# EAGLE design MurataBreakout_rev2 (EAGLE 8.3.1)
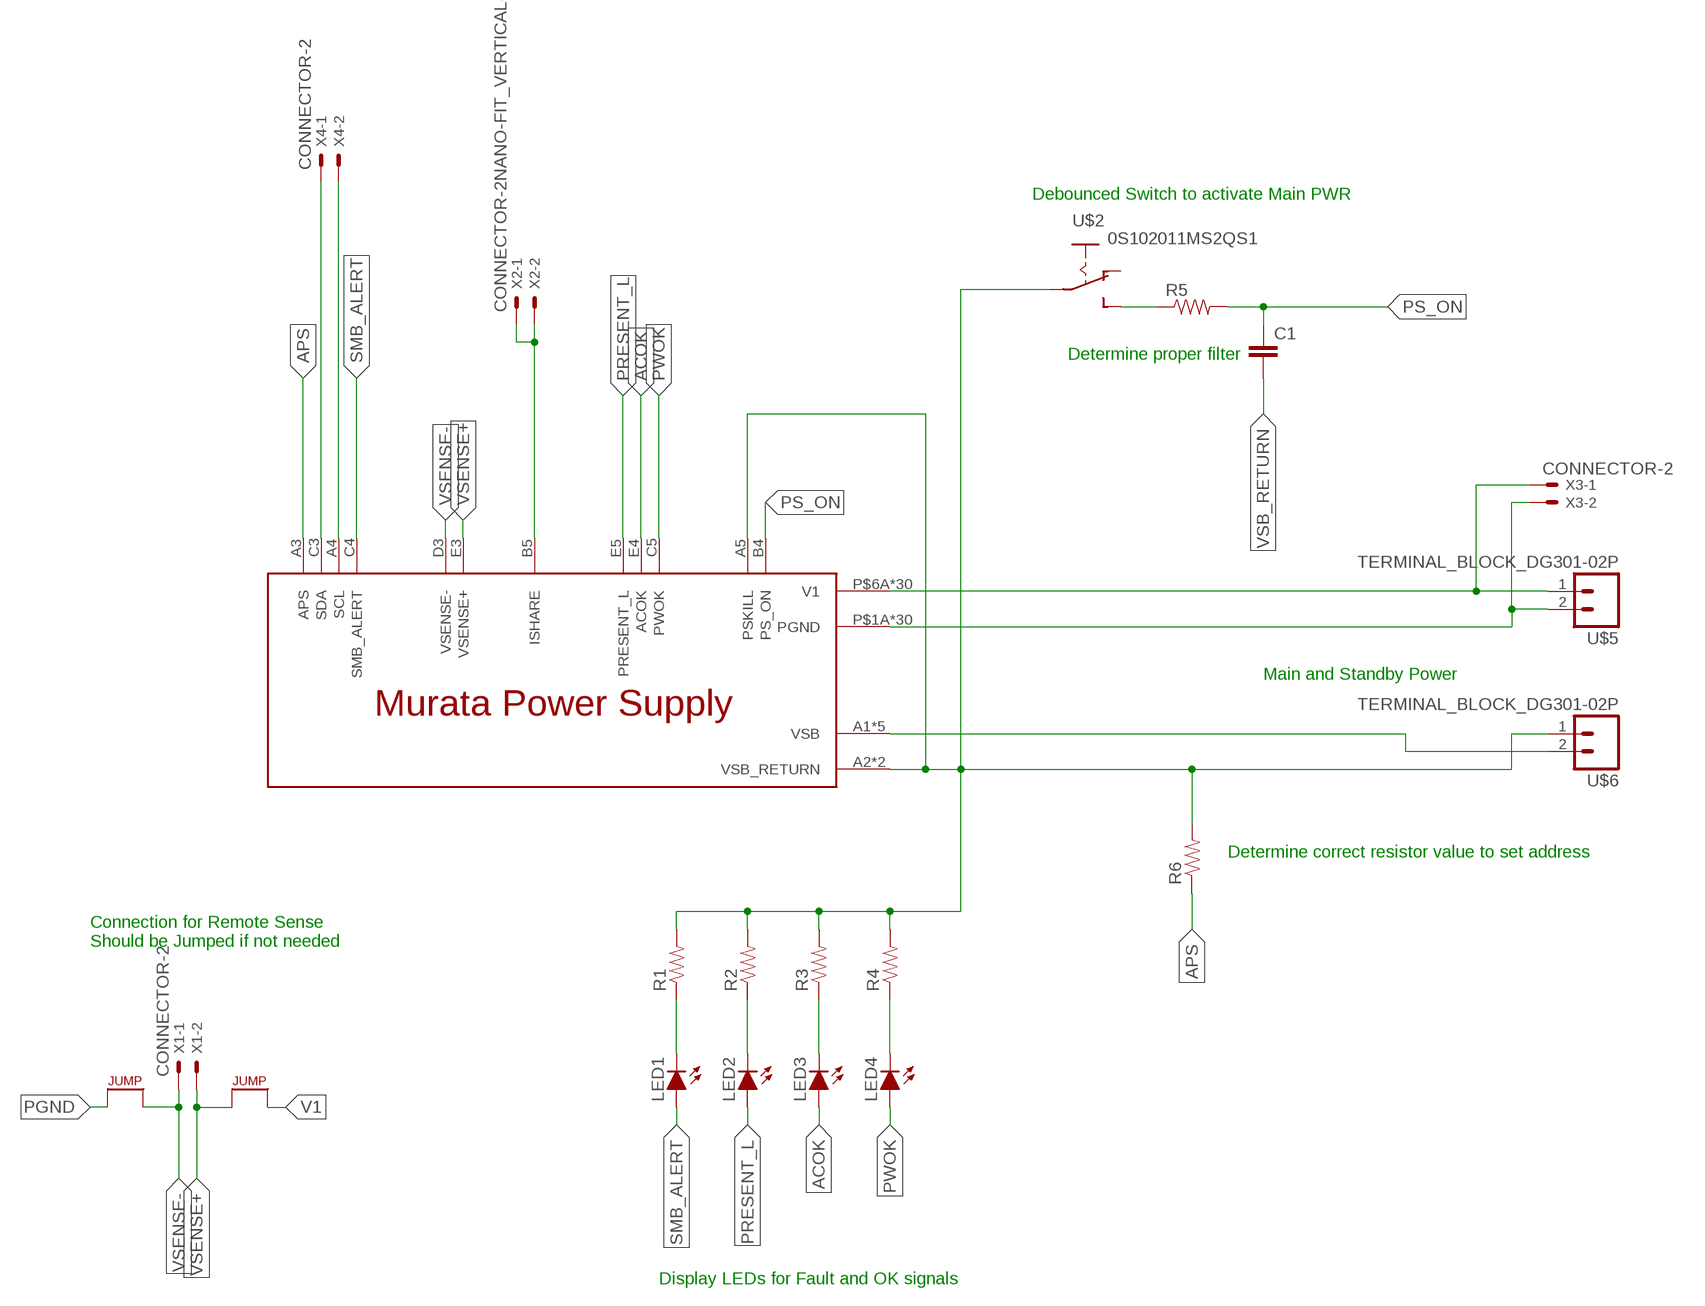
[diagram p0: schematic, sheet 1]

## Parts
C1  CAP0805  [0805]
LED1  LED-0805  [LED-805]
LED2  LED-0805  [LED-805]
LED3  LED-0805  [LED-805]
LED4  LED-0805  [LED-805]
R1  RESISTOR0805-RES  [0805]
R2  RESISTOR0805-RES  [0805]
R3  RESISTOR0805-RES  [0805]
R4  RESISTOR0805-RES  [0805]
R5  RESISTOR0805-RES  [0805]
R6  RESISTOR0805-RES  [0805]
U$1  MURATA_POWER_SUPPLY  [MURATA_POWER_SUPPLY_CONNECTOR]
U$2  0S102011MS2QS1  [0S102011MS2QS1]
U$3  JUMPER.1  [1X02]
U$4  JUMPER.1  [1X02]
U$5  TERMINAL_BLOCK_DG301-02P  [DG301-02P]
U$6  TERMINAL_BLOCK_DG301-02P  [DG301-02P]
X1  CONNECTOR-2  [MINIFIT_5566-2]
X2  CONNECTOR-2NANO-FIT_VERTICAL-2  [NANO-FIT_VERTICAL-2]
X3  CONNECTOR-2  [MINIFIT_5566-2]
X4  CONNECTOR-2  [MINIFIT_5566-2]

## Nets
ACOK: LED3.A U$1.E4(ACOK)
APS: R6.1 U$1.A3(APS)
N$1: LED4.C R4.1
N$2: LED3.C R3.1
N$3: LED2.C R2.1
N$4: LED1.C R1.1
N$5: U$1.B5(ISHARE) X2.P$1 X2.P$2
N$6: R5.1 U$2.P$3(S)
N$7: U$1.A1(VSB) U$1.B1(VSB) U$1.C1(VSB) U$1.D1(VSB) U$1.E1(VSB) U$6.2
PGND: U$1.P$1A(PGND) U$1.P$1B(PGND) U$1.P$1C(PGND) U$1.P$1D(PGND) U$1.P$1E(PGND) U$1.P$1F(PGND) U$1.P$2A(PGND) U$1.P$2B(PGND) U$1.P$2C(PGND) U$1.P$2D(PGND) U$1.P$2E(PGND) U$1.P$2F(PGND) U$1.P$3A(PGND) U$1.P$3B(PGND) U$1.P$3C(PGND) U$1.P$3D(PGND) U$1.P$3E(PGND) U$1.P$3F(PGND) U$1.P$4A(PGND) U$1.P$4B(PGND) U$1.P$4C(PGND) U$1.P$4D(PGND) U$1.P$4E(PGND) U$1.P$4F(PGND) U$1.P$5A(PGND) U$1.P$5B(PGND) U$1.P$5C(PGND) U$1.P$5D(PGND) U$1.P$5E(PGND) U$1.P$5F(PGND) U$4.1 U$5.2 X3.2
PRESENT_L: LED2.A U$1.E5(PRESENT_L)
PS_ON: C1.1 R5.2 U$1.B4(PS_ON)
PWOK: LED4.A U$1.C5(PWOK)
SCL: U$1.A4(SCL) X4.2
SDA: U$1.C3(SDA) X4.1
SMB_ALERT: LED1.A U$1.C4(SMB_ALERT)
V1: U$1.P$6A(V1) U$1.P$6B(V1) U$1.P$6C(V1) U$1.P$6D(V1) U$1.P$6E(V1) U$1.P$6F(V1) U$1.P$7A(V1) U$1.P$7B(V1) U$1.P$7C(V1) U$1.P$7D(V1) U$1.P$7E(V1) U$1.P$7F(V1) U$1.P$8A(V1) U$1.P$8B(V1) U$1.P$8C(V1) U$1.P$8D(V1) U$1.P$8E(V1) U$1.P$8F(V1) U$1.P$9A(V1) U$1.P$9B(V1) U$1.P$9C(V1) U$1.P$9D(V1) U$1.P$9E(V1) U$1.P$9F(V1) U$1.P$10A(V1) U$1.P$10B(V1) U$1.P$10C(V1) U$1.P$10D(V1) U$1.P$10E(V1) U$1.P$10F(V1) U$3.2 U$5.1 X3.1
VSB_RETURN: C1.2 R1.2 R2.2 R3.2 R4.2 R6.2 U$1.A2(VSB_RETURN) U$1.A5(PSKILL) U$1.B2(VSB_RETURN) U$2.P$2(P) U$6.1
VSENSE+: U$1.E3(VSENSE+) U$3.1 X1.2
VSENSE-: U$1.D3(VSENSE-) U$4.2 X1.1
Unconnected: U$2.P$1(O)

## Notes on the sheet
- Debounced Switch to activate Main PWR
- Determine proper filter
- Main and Standby Power
- Determine correct resistor value to set address
- Connection for Remote Sense
  Should be Jumped if not needed
- Display LEDs for Fault and OK signals

## Library data of the parts
C1 = HyTechDevices:CAP: Capacitor Standard 0603 ceramic capacitor, and 0.1" leaded capacitor.
LED1-LED4 = HyTechDevices:LED: Light Emitting Diode (LED) Source: Dangerous Prototypes Eagle Library <https://github.com/DangerousPrototypes/Eagle_Part_Library>
R1-R6 = HyTechDevices:RESISTOR: Resistor Basic schematic elements and footprints for 0603, 1206, and PTH resistors.
U$1 = HyTechDevices:MURATA_POWER_SUPPLY
U$2 = HyTechDevices:0S102011MS2QS1: Slide Switch 0S102011MS2QS1
U$3 U$4 = HyTechDevices:JUMPER: Jumper for changing operation of a device
U$5 U$6 = HyTechDevices:TERMINAL_BLOCK_DG301-02P: DG301-02P Terminal block Tayda Electronics Store <http://www.taydaelectronics.com/connectors-sockets/terminal-blocks/dg301-screw-terminal-block-2-positions-5mm.html> Datasheet <http://www.tme.eu/en/Document/72ad9f371bb0c16572574ac47903b3a1/DG301-5.0.pdf> Specs: Positions: 2 Pitch: 5.00mm Wire: 12-24 AWG Max Current: 15A Max Voltage: 300V
X1 X3 X4 = HyTechDevices:CONNECTOR-2: Mini-Fit Junior connector 2 pole Source: http://www.molex.com; OC_FARNELL: 1822072; OC_NEWARK: unknown
X2 = HyTechDevices:CONNECTOR-2: Mini-Fit Junior connector 2 pole Source: http://www.molex.com

## Board
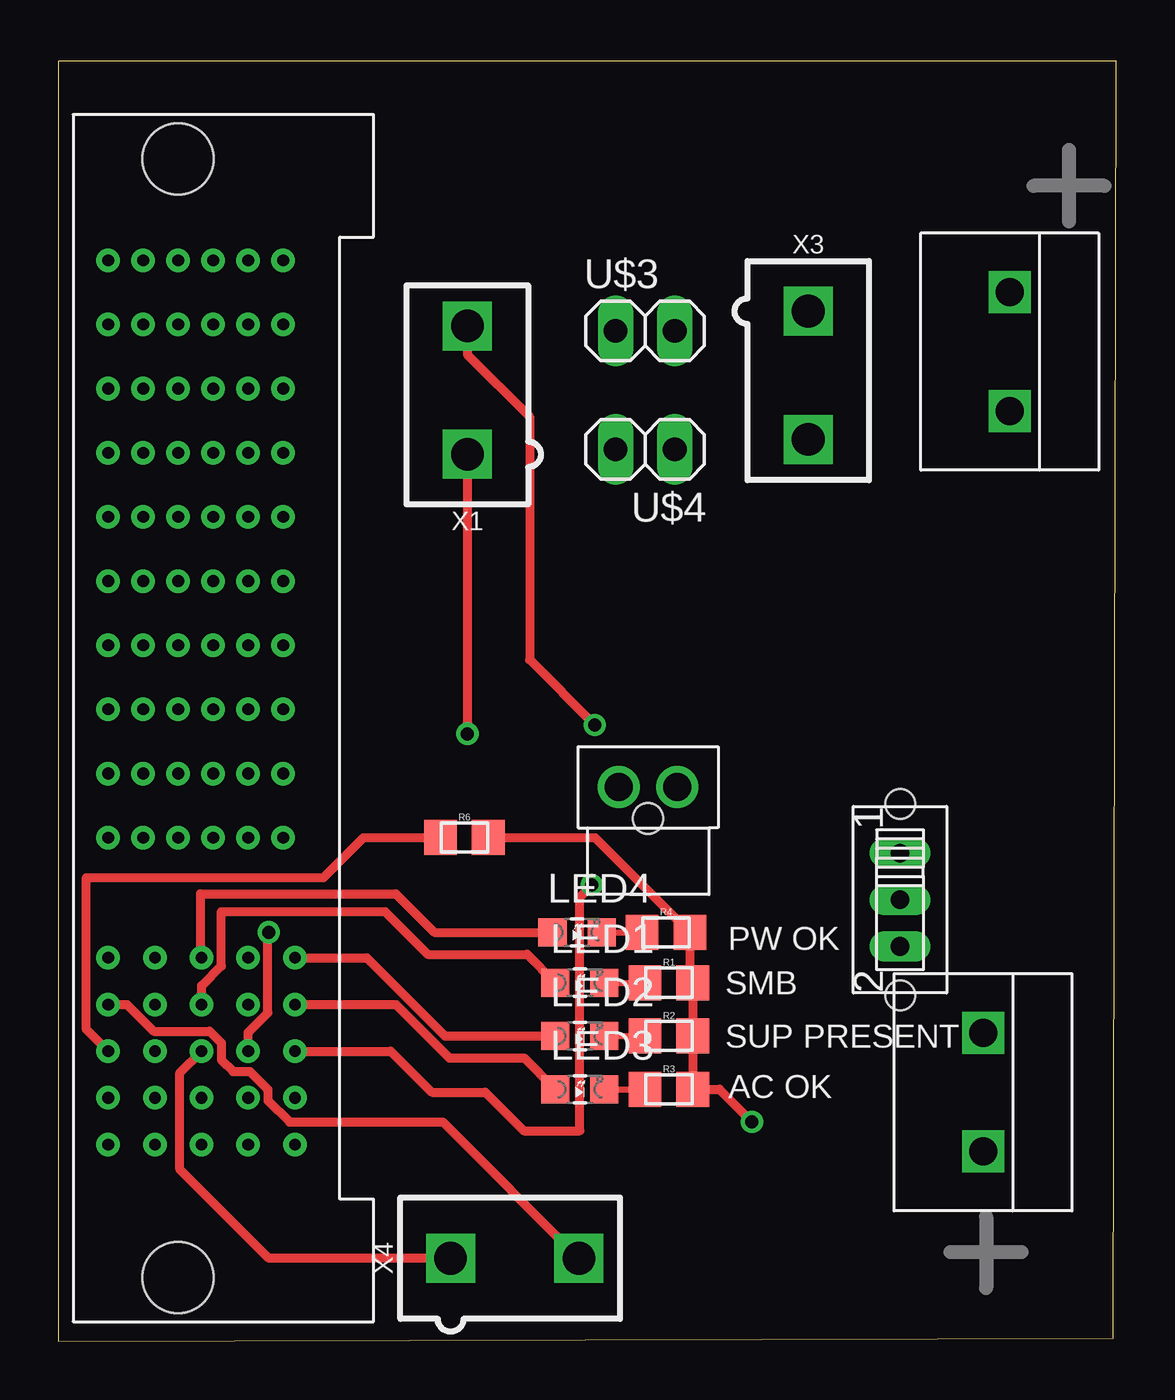
[diagram p1: board, top side]
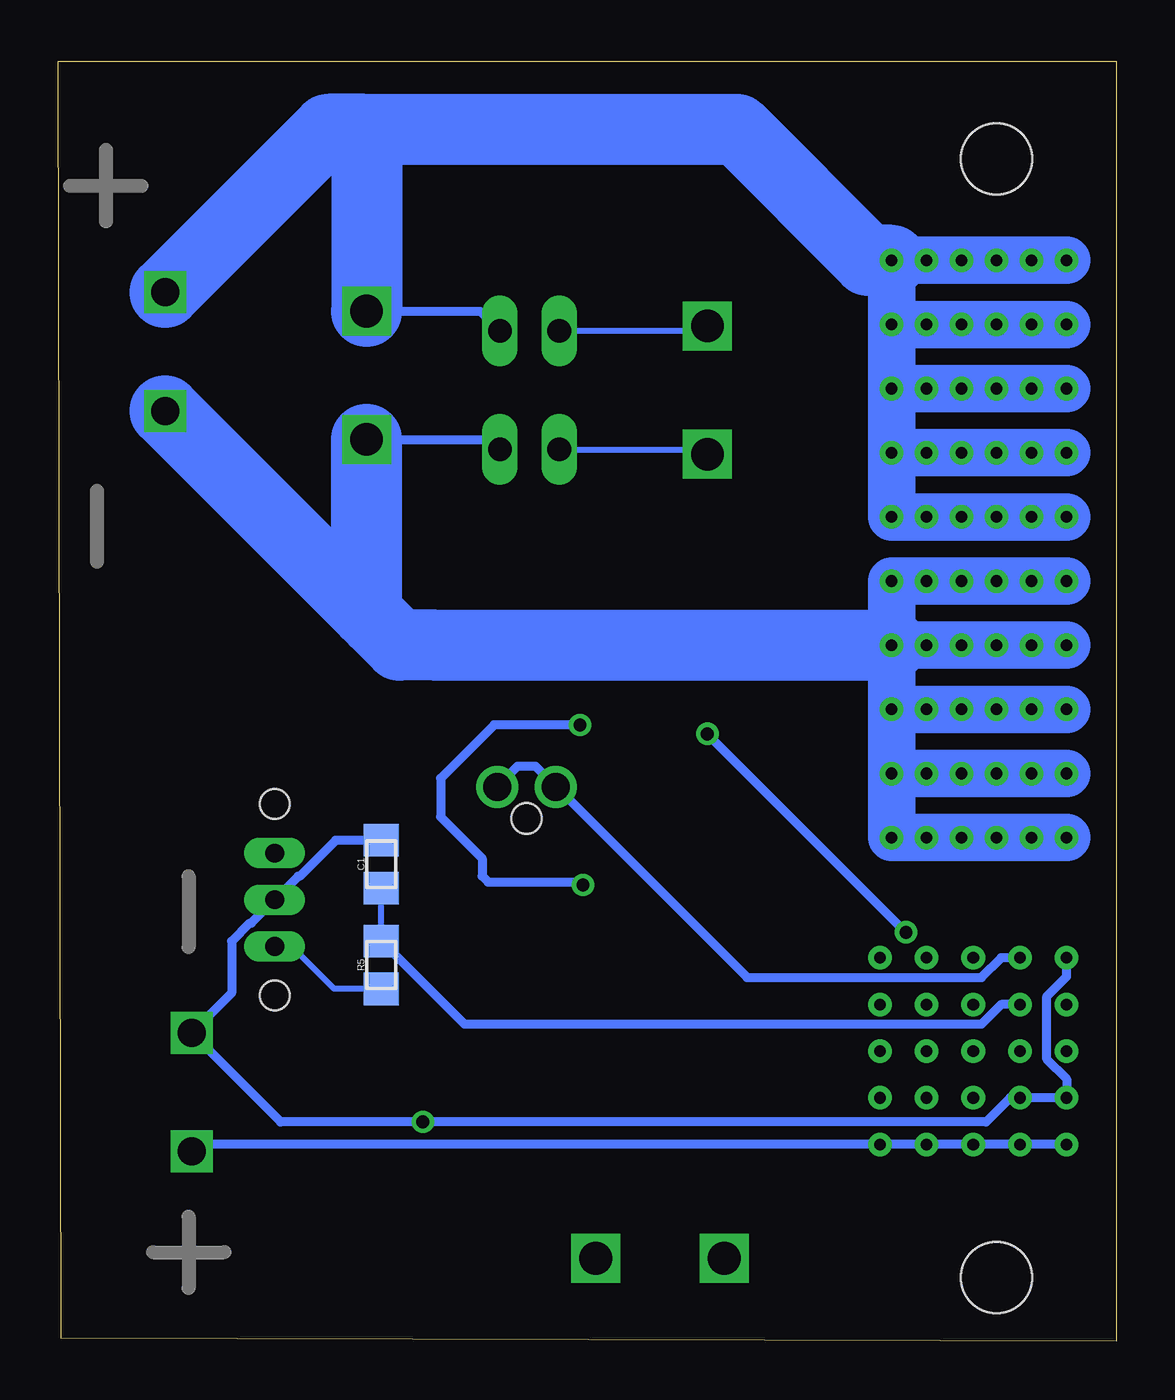
[diagram p2: board, bottom side, seen from below]

Size 45.34 x 54.86 mm. Coordinates in mm from the lower left corner, seen from the top.
Outline: 0,0 45.21,0.13 45.34,54.86 0,54.86 0,0
Copper layers (1*16): Top 0.035mm / dielectric 1.5mm / Bottom 0.035mm
Design rules "DRC Advanced Circuits": minimum track width 6mil, minimum drill 15mil, track to track 6mil, track to pad 6mil, pad to pad 6mil, via to via 6mil, smd to smd 6mil, copper to edge 40mil, drill to drill 6mil, minimum pad ring 10mil, minimum via ring 8mil, stop-mask expansion 4mil, vias tented up to drill 0mil, thermal gap 10mil

### Footprints (pad centres in the part's own frame; a part is rotated, then mirrored left to right if it is on the bottom)
0805 = smd 1.4 x 1.5: 1 -1.025,0; 2 1.025,0
LED-805 = smd 1.2 x 1.2: A 0,-1.05; C 0,1.05
MURATA_POWER_SUPPLY_CONNECTOR = drill 0.5: A1 44.145,1.5; A2 42.145,1.5; A3 40.145,1.5; A4 38.145,1.5; A5 36.145,1.5; B1 44.145,3.5; B2 42.145,3.5; B3 40.145,3.5; B4 38.145,3.5; B5 36.145,3.5; C1 44.145,5.5; C2 42.145,5.5; C3 40.145,5.5; C4 38.145,5.5; C5 36.145,5.5; D1 44.145,7.5; D2 42.145,7.5; D3 40.145,7.5; D4 38.145,7.5; D5 36.145,7.5; E1 44.145,9.5; E2 42.145,9.5; E3 40.145,9.5; E4 38.145,9.5; E5 36.145,9.5; P$1A 30.995,9; P$1B 30.995,7.5; P$1C 30.995,6; P$1D 30.995,4.5; P$1E 30.995,3; P$1F 30.995,1.5; P$2A 28.245,9; P$2B 28.245,7.5; P$2C 28.245,6; P$2D 28.245,4.5; P$2E 28.245,3; P$2F 28.245,1.5; P$3A 25.495,9; P$3B 25.495,7.5; P$3C 25.495,6; P$3D 25.495,4.5; P$3E 25.495,3; P$3F 25.495,1.5; P$4A 22.745,9; P$4B 22.745,7.5; P$4C 22.745,6; P$4D 22.745,4.5; P$4E 22.745,3; P$4F 22.745,1.5; P$5A 19.995,9; P$5B 19.995,7.5; P$5C 19.995,6; P$5D 19.995,4.5; P$5E 19.995,3; P$5F 19.995,1.5; P$6A 17.245,9; P$6B 17.245,7.5; P$6C 17.245,6; P$6D 17.245,4.5; P$6E 17.245,3; P$6F 17.245,1.5; P$7A 14.495,9; P$7B 14.495,7.5; P$7C 14.495,6; P$7D 14.495,4.5; P$7E 14.495,3; P$7F 14.495,1.5; P$8A 11.745,9; P$8B 11.745,7.5; P$8C 11.745,6; P$8D 11.745,4.5; P$8E 11.745,3; P$8F 11.745,1.5; P$9A 8.995,9; P$9B 8.995,7.5; P$9C 8.995,6; P$9D 8.995,4.5; P$9E 8.995,3; P$9F 8.995,1.5; P$10A 6.245,9; P$10B 6.245,7.5; P$10C 6.245,6; P$10D 6.245,4.5; P$10E 6.245,3; P$10F 6.245,1.5 | hole 3.05: 1.9,4.5; 49.84,4.5
0S102011MS2QS1 = drill 0.8 long: P$1 -2,0; P$2 0,0; P$3 2,0 | hole 1.27: 4.102,0; -4.102,0
1X02 = drill 1.016 long: 1 -1.27,0; 2 1.27,0
DG301-02P = drill 1.2 square: 1 2.54,3.81; 2 7.62,3.81
MINIFIT_5566-2 = drill 1.4 square: 1 0,-2.75; 2 0,2.75
NANO-FIT_VERTICAL-2 = drill 1.2: P$1 -1.25,0; P$2 1.25,0 | hole 1.3: 0,-1.34

### Placement (x,y rotation side)
C1  31.5,20.45 90 bottom
LED1  22.35,15.37 270 top
LED2  22.35,13.08 270 top
LED3  22.35,10.79 270 top
LED4  22.23,17.53 270 top
R1  26.16,15.37 0 top
R2  26.16,13.08 0 top
R3  26.16,10.79 0 top
R4  26.04,17.53 0 top
R5  31.5,16.13 90 bottom
R6  17.4,21.59 0 top
U$1  0.64,52.58 270 top
U$2  36.07,18.92 270 top
U$3  25.15,43.31 0 top
U$4  25.15,38.23 180 top
U$5  36.96,47.5 270 top
U$6  35.81,15.75 270 top
X1  17.53,40.77 0 top
X2  25.27,23.75 0 top
X3  32.13,41.4 180 top
X4  19.56,3.56 270 top

### Tracks (layer width: path | path; a pad name or v marks a point on that pad's centre or on a via)
ACOK
  Top 0.381: LED3.A 19.96,12.14 16.75,12.14 14.46,14.43 U$1.E4
APS
  Top 0.381: R6.1 13.08,21.59 11.37,19.88 1.21,19.88 1.21,13.36 U$1.A3
N$1
  Top 0.254: LED4.C R4.1
N$2
  Top 0.254: LED3.C R3.1
N$3
  Top 0.254: LED2.C R2.1
N$4
  Top 0.254: LED1.C R1.1
N$5
  Bottom 0.381: U$1.B5 4.94,16.43 5.78,15.59 15.83,15.59 23.99,23.75 X2.P$1 24.02,23.77 24.89,24.64 25.67,24.64 26.54,23.77 X2.P$2
N$6
  Bottom 0.152: 31.51,15.11 R5.1
  Bottom 0.254: U$2.P$3 35.34,16.92 33.53,15.11 31.51,15.11
N$7
  Bottom 0.381: U$1.A1 U$1.B1 U$1.C1 U$1.D1 U$1.E1 39.32,8.43 U$6.2
PGND
  Bottom 0.305: 29.21,29.89 29.16,29.83
  Bottom 0.381: X3.2 26.84,38.65 U$4.1
  Bottom 2.032: U$1.P$4A U$1.P$4B U$1.P$4C U$1.P$4D U$1.P$4E U$1.P$4F | U$1.P$3A U$1.P$3B U$1.P$3C U$1.P$3D U$1.P$3E U$1.P$3F | U$1.P$2A U$1.P$2B U$1.P$2C U$1.P$2D U$1.P$2E U$1.P$2F | U$1.P$1F U$1.P$1E U$1.P$1D U$1.P$1C U$1.P$1B U$1.P$1A U$1.P$2A | U$1.P$5F U$1.P$5E U$1.P$5D U$1.P$5C U$1.P$5B U$1.P$5A U$1.P$4A | U$1.P$4A U$1.P$3A | U$1.P$3A U$1.P$2A
  Bottom 3.048: U$1.P$4A 29.16,29.83 30.72,29.83 31.77,30.88 | 31.77,30.88 U$5.2 | X3.2 32.13,31.24 31.77,30.88
PRESENT_L
  Top 0.381: LED2.A 16.57,13.08 13.21,16.43 U$1.E5
PS_ON
  Bottom 0.254: R5.2 C1.1
  Bottom 0.381: U$1.B4 4.94,14.43 5.78,13.59 27.93,13.59 R5.2
PWOK
  Top 0.381: LED4.A 16.11,17.53 14.46,19.18 6.1,19.18 6.1,16.47 U$1.C5
SCL
  Top 0.381: U$1.A4 2.94,14.43 4.09,13.28 6.49,13.28 6.98,12.78 6.98,12.07 7.49,11.56 8.21,11.56 8.98,10.78 8.98,10.32 9.91,9.4 16.47,9.4 X4.2
SDA
  Top 0.381: X4.1 9.02,3.56 5.21,7.37 5.21,11.51 U$1.C3
SMB_ALERT
  Top 0.152: LED1.A 21.12,15.19
  Top 0.381: U$1.C4 6.13,15.23 6.98,16.08 6.98,18.41 13.99,18.41 15.82,16.58 20.09,16.58 LED1.A
V1
  Bottom 0.305: 29.21,51.76 29.39,51.94
  Bottom 0.381: X3.1 27.26,44.15 U$3.2
  Bottom 2.032: U$1.P$9A U$1.P$9B U$1.P$9C U$1.P$9D U$1.P$9E U$1.P$9F | U$1.P$8A U$1.P$8B U$1.P$8C U$1.P$8D U$1.P$8E U$1.P$8F | U$1.P$7A U$1.P$7B U$1.P$7C U$1.P$7D U$1.P$7E U$1.P$7F | U$1.P$6F U$1.P$6E U$1.P$6D U$1.P$6C U$1.P$6B U$1.P$6A U$1.P$7A | U$1.P$10F U$1.P$10E U$1.P$10D U$1.P$10C U$1.P$10B U$1.P$10A U$1.P$9A | U$1.P$8A U$1.P$9A | U$1.P$7A U$1.P$8A
  Bottom 3.048: U$1.P$10A 10.65,46.33 16.26,51.94 29.39,51.94 32.22,51.94 | 32.22,51.94 33.78,51.94 U$5.1 | X3.1 32.13,51.85 32.22,51.94
VSB_RETURN  (via drill 0.55)
  Top 0.381: R6.2 23,21.59 R4.2 27.06,15.49 R1.2 R2.2 R3.2 28.32,10.79 v29.72,9.4
  Bottom 0.381: U$1.A5 2.13,15.63 2.98,14.78 2.98,12.08 2.13,11.23 U$1.A2 U$1.B2 4.55,10.43 5.59,9.4 v29.72,9.4 35.81,9.4 U$6.1 37.91,14.92 37.91,17.14 37.13,17.92 37.07,17.92 U$2.P$2 35.07,19.93 35,19.93 33.45,21.47 C1.2
VSENSE+  (via drill 0.55)
  Top 0.381: X1.2 17.53,42.29 20.19,39.62 20.19,29.21 v22.99,26.42 | U$1.E3 14.24,12.43 16,10.67 18.29,10.67 19.94,9.02 22.35,9.02 22.35,16.76 22.33,16.78 22.33,19.03 v22.86,19.56
  Bottom 0.254: U$3.1 17.74,43.31 X1.2
  Bottom 0.381: v22.99,26.42 26.67,26.42 28.96,24.13 28.96,22.48 27.18,20.7 27.18,19.94 26.92,19.68 22.99,19.68 v22.86,19.56
VSENSE-  (via drill 0.55)
  Top 0.381: U$1.D3 8.13,13.23 8.98,14.08 8.98,17.49 v9.02,17.53 | X1.1 v17.53,26.04 17.53,25.91
  Bottom 0.254: U$4.2 17.74,38.23 X1.1
  Bottom 0.381: v17.53,26.04 v9.02,17.53

### Text on the board
tPlace: PW OK | SMB | SUP PRESENT | AC OK
tDocu: Parker Jones